# EAGLE design SparkFun_Qwiic_Speaker_Amp (EAGLE 9.6.2)
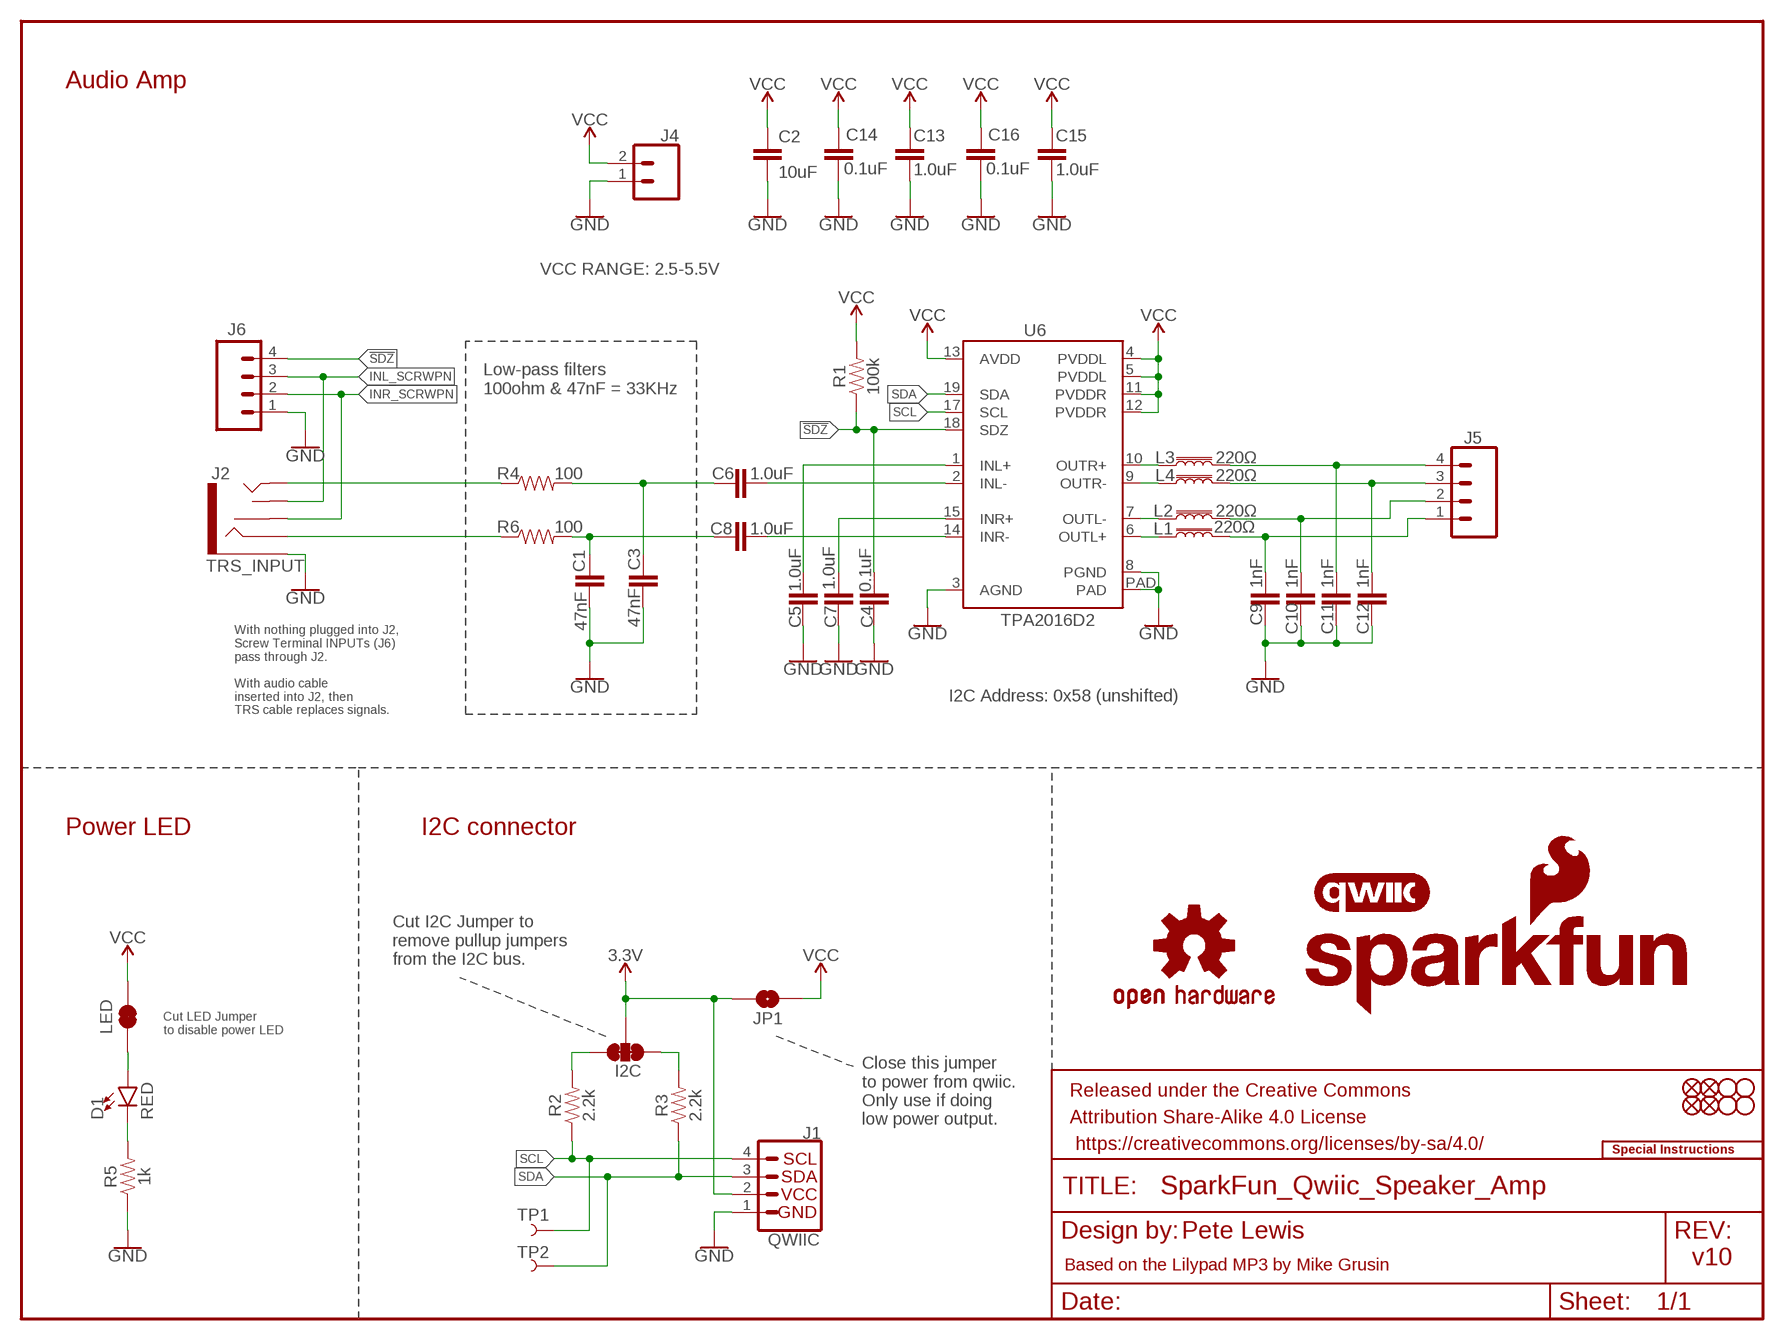
[diagram p0: schematic, sheet 1]

## Parts
C1  47nF  47NF-0402_TIGHT-25V-10%-X7R  [0402-TIGHT]
C2  10uF  10UF-0805-25V-10%  [0805]
C3  47nF  47NF-0402_TIGHT-25V-10%-X7R  [0402-TIGHT]
C4  0.1uF  0.1UF-0402T-16V-10%-X7R-WE  [0402-TIGHT]
C5  1.0uF  1.0UF-0402T-16V-10%  [0402-TIGHT]
C6  1.0uF  1.0UF-0402T-16V-10%  [0402-TIGHT]
C7  1.0uF  1.0UF-0402T-16V-10%  [0402-TIGHT]
C8  1.0uF  1.0UF-0402T-16V-10%  [0402-TIGHT]
C9  1nF  1.0NF/1000PF-0402-25V-10%-X7R  [0402]
C10  1nF  1.0NF/1000PF-0402-25V-10%-X7R  [0402]
C11  1nF  1.0NF/1000PF-0402-25V-10%-X7R  [0402]
C12  1nF  1.0NF/1000PF-0402-25V-10%-X7R  [0402]
C13  1.0uF  1.0UF-0402T-16V-10%  [0402-TIGHT]
C14  0.1uF  0.1UF-0402T-16V-10%-X7R-WE  [0402-TIGHT]
C15  1.0uF  1.0UF-0402T-16V-10%  [0402-TIGHT]
C16  0.1uF  0.1UF-0402T-16V-10%-X7R-WE  [0402-TIGHT]
D1  RED  LED-RED0603  [LED-0603]
FD1  FIDUCIAL1X2  [FIDUCIAL-1X2]
FD2  FIDUCIAL1X2  [FIDUCIAL-1X2]
FD3  FIDUCIAL1X2  [FIDUCIAL-1X2]
FD4  FIDUCIAL1X2  [FIDUCIAL-1X2]
FRAME2  FRAME-LETTER  [CREATIVE_COMMONS]
H1  STAND-OFFTIGHT  [STAND-OFF-TIGHT]
H2  STAND-OFFTIGHT  [STAND-OFF-TIGHT]
H3  STAND-OFFTIGHT  [STAND-OFF-TIGHT]
H4  STAND-OFFTIGHT  [STAND-OFF-TIGHT]
I2C  JUMPER-SMT_3_2-NC_TRACE_SILK  [SMT-JUMPER_3_2-NC_TRACE_SILK]
J1  QWIIC  QWIIC_CONNECTORJS-1MM  [JST04_1MM_RA]
J2  TRS_INPUT  AUDIO_JACK_3.5MM_SMD  [AUDIO-JACK-3.5MM-SMD]
J4  CONN_023.5MM  [SCREWTERMINAL-3.5MM-2]
J5  CONN_04SCREW  [SCREWTERMINAL-3.5MM-4]
J6  SCREW  CONN_04SCREW  [SCREWTERMINAL-3.5MM-4]
JP1  JP1  JUMPER-SMT_2_NO_SILK  [SMT-JUMPER_2_NO_SILK]
L1  220Ω  FERRITE_BEAD-0805-220Ω-100MHZ-2A  [0805]
L2  220Ω  FERRITE_BEAD-0805-220Ω-100MHZ-2A  [0805]
L3  220Ω  FERRITE_BEAD-0805-220Ω-100MHZ-2A  [0805]
L4  220Ω  FERRITE_BEAD-0805-220Ω-100MHZ-2A  [0805]
LED  JUMPER-SMT_2_NC_TRACE_SILK  [SMT-JUMPER_2_NC_TRACE_SILK]
LOGO2  SFE_LOGO_NAME_FLAME.1_INCH  [SFE_LOGO_NAME_FLAME_.1]
LOGO3  QWIIC_LOGO_4MM  [QWIIC_4MM]
LOGO4  OSHW-LOGOS  [OSHW-LOGO-S]
LOGO6  SPECIAL_INSTRUCTIONS-ORDERING  [ORDERING_INSTRUCTIONS]
R1  100k  100KOHM-0402T-1/16W-1%  [0402-TIGHT]
R2  2.2k  2.2KOHM-0402T-1/16W-1%  [0402-TIGHT]
R3  2.2k  2.2KOHM-0402T-1/16W-1%  [0402-TIGHT]
R4  100  100OHM-0402-TIGHT-1/16W-1%  [0402-TIGHT]
R5  1k  1KOHM-0402T-1/16W-1%  [0402-TIGHT]
R6  100  100OHM-0402-TIGHT-1/16W-1%  [0402-TIGHT]
TP1  TEST-POINTTP_15TH_THRU  [TP_15TH]
TP2  TEST-POINTTP_15TH_THRU  [TP_15TH]
U6  TPA2016D2  TPA2016D2RTJ  [QFN-20-0.5MM]

## Nets
3.3V: I2C.2 J1.2 JP1.1
!SDZ!: C4.1 J6.4 R1.1 U6.18(SDZ)
GND: C1.2 C2.2 C3.2 C4.2 C5.1 C7.1 C9.2 C10.2 C11.2 C12.2 C13.2 C14.2 C15.2 C16.2 J1.1 J2.SLEEVE J4.1 J6.1 R5.1 U6.3(AGND) U6.8(PGND) U6.PAD
INL: J2.TIP R4.1
INL_SCRWPN: J2.TSH J6.3
INR: J2.RING R6.1
INR_SCRWPN: J2.RSH J6.2
N$1: L1.1 U6.6(OUTL+)
N$2: L2.1 U6.7(OUTL-)
N$3: C1.1 C8.1 R6.2
N$4: D1.C R5.2
N$5: C3.1 C6.1 R4.2
N$6: D1.A LED.1
N$16: I2C.3 R2.2
N$17: I2C.1 R3.2
N$18: L3.1 U6.10(OUTR+)
N$19: L4.1 U6.9(OUTR-)
N$20: C8.2 U6.14(INR-)
N$21: C5.2 U6.1(INL+)
N$22: C6.2 U6.2(INL-)
N$25: C7.2 U6.15(INR+)
SCL: J1.4 R2.1 TP1.1 U6.17(SCL)
SDA: J1.3 R3.1 TP2.1 U6.19(SDA)
SPK_L_+: C9.1 J5.1 L1.2
SPK_L_-: C10.1 J5.2 L2.2
SPK_R_+: C11.1 J5.4 L3.2
SPK_R_-: C12.1 J5.3 L4.2
VCC: C2.1 C13.1 C14.1 C15.1 C16.1 J4.2 JP1.2 LED.2 R1.2 U6.4(PVDDL) U6.5(PVDDL) U6.11(PVDDR) U6.12(PVDDR) U6.13(AVDD)

## Notes on the sheet
- Audio Amp
- VCC RANGE: 2.5-5.5V
- Low-pass filters
  100ohm & 47nF = 33KHz
- I2C Address: 0x58 (unshifted)
- With nothing plugged into J2,
  Screw Terminal INPUTs (J6)
  pass through J2.
  
  With audio cable
  inserted into J2, then
  TRS cable replaces signals.
- Power LED | I2C connector
- Cut I2C Jumper to 
  remove pullup jumpers 
  from the I2C bus.
- Cut LED Jumper
  to disable power LED
- Close this jumper
  to power from qwiic.
  Only use if doing
  low power output.
- Pete Lewis
- v10
- Based on the Lilypad MP3 by Mike Grusin

## Library data of the parts
C1 C3 = SparkFun-Capacitors:47NF: 47nF ceramic capacitors A capacitor is a passive two-terminal electrical component used to store electrical energy temporarily in an electric field.; PROD_ID: CAP-14243
C2 = SparkFun-Capacitors:10UF: 10.0µF ceramic capacitors A capacitor is a passive two-terminal electrical component used to store electrical energy temporarily in an electric field.; PROD_ID: CAP-14259
C4 C14 C16 = SparkFun-Capacitors:0.1UF: 0.1µF ceramic capacitors A capacitor is a passive two-terminal electrical component used to store electrical energy temporarily in an electric field.; PROD_ID: CAP-16507
C5-C8 C13 C15 = SparkFun-Capacitors:1.0UF: 1µF ceramic capacitors A capacitor is a passive two-terminal electrical component used to store electrical energy temporarily in an electric field.; PROD_ID: CAP-12417
C9-C12 = SparkFun-Capacitors:1.0NF/1000PF: 1nF/1,000pF ceramic capacitors A capacitor is a passive two-terminal electrical component used to store electrical energy temporarily in an electric field.; PROD_ID: CAP-15061
D1 = SparkFun-LED:LED-RED: Red SMD LED Used in manufacturing of most products at SparkFun Packages: 0603 - SMD 0603 package [Product Link] <http://docs.avagotech.com/docs/AV02-0551EN> 0603 SMART - SMD 0603 SMART package ( more efficient and expensive)[Product Link] <http://www.osram-os.com/Graphics/XPic2/00077099_0.pdf> 1206 - SMD1206 package [Product Link] <https://www.sparkfun.com/datasheets/DevTools/LilyPad/Q150OVS4.pdff> SparkFun Products: Pro Mini 328 -5V <https://www.sparkfun.com/products/821> RedBoard <https://www.sparkfun.com/products/12757> IOIO-OTG <https://www.sparkfun.com/products/13613>; PROD_ID: DIO-00819
FD1-FD4 = SparkFun-Aesthetics:FIDUCIAL: Fiducial Alignment Points Point-of-reference for pick-and-place machines and other optical instruments.
FRAME2 = SparkFun-Aesthetics:FRAME-LETTER: Schematic Frame - Letter Standard 8.5x11 US Letter frame
H1-H4 = SparkFun-Hardware:STAND-OFF: Stand Off Drill holes for mechanically mounting via screws, standoffs, etc. Note: Use the keepout ring to avoid running the screw head into surrounding components. Variant Overviews STAND-OFF - Mechanical footprint for a #4 phillips button head screw. STAND-OFF-TIGHT - Mechanical footprint for a #4 phillips button head screw, Example SparkFun Products Screw - Phillips Head (1/4", 4-40, 10 pack) <https://www.sparkfun.com/products/10453> (PRT-10453) Screw - Phillips Head (1/2", 4-40, 10 pack) <https://www.sparkfun.com/products/10452> (PRT-10452) Screw - Phillips Head (3/4", 4-40, 10 pack) <https://www.sparkfun.com/products/10451> (PRT-10451) Screw - Phillips Head (1", 4-40, 10 pack) <https://www.sparkfun.com/products/10450> (PRT-10450)
I2C = SparkFun-Jumpers:JUMPER-SMT_3_2-NC_TRACE: Normally closed trace jumper (2 of 2 connections) This jumper has a trace between all three pads so they are normally closed (NC). Use a razor knife to open the connection(s). For best results follow the IPC guidelines for cutting traces: Cutout at least 0.063 mm (0.005 in). Remove all loose material to clean up the cut area. Seal the cut with an approved epoxy. Reapply solder to reclose the connection(s).
J1 = SparkFun-Connectors:QWIIC_CONNECTOR: SparkFun I2C Standard Qwiic Connector An SMD 1mm pitch JST connector makes it easy and quick (get it? Qwiic?) to connect I2C devices to each other. The Qwiic system <http://www.sparkfun.com/qwiic> enables fast and solderless connection between popular platforms and various sensors and actuators. We carry 200mm <https://www.sparkfun.com/products/14204>, 100mm <https://www.sparkfun.com/products/14205>, 50mm <https://www.sparkfun.com/products/14206>, and breadboard friendly <https://www.sparkfun.com/products/14207> Qwiic cables. We also offer 10 pcs strips <https://www.sparkfun.com/products/14323> the SMD connectors.; PROD_ID: CONN-13694; VALUE: QWIIC_RIGHT_ANGLE
J2 = SparkFun-Connectors:AUDIO_JACK_3.5MM: Audio Jack 3.5mm variants of PTH and SMT stereo audio jack with bypass switches. SparkFun Products: SparkFun SparkPunk Sound Kit <[https://www.sparkfun.com/products/11177]> - PTH MP3 Trigger <https://www.sparkfun.com/products/13720> -3.5mm SMD SparkFun PicoBoard <https://www.sparkfun.com/products/11888>- 2.5mm SMD; PROD_ID: CONN-10353
J4 = SparkFun-Connectors:CONN_02: Multi connection point. Often used as Generic Header-pin footprint for 0.1 inch spaced/style header connections On any of the 0.1 inch spaced packages, you can populate with these: Break Away Headers - Straight <https://www.sparkfun.com/products/116> (PRT-00116) Break Away Male Headers - Right Angle <https://www.sparkfun.com/products/553> (PRT-00553) Female Headers <https://www.sparkfun.com/products/115> (PRT-00115) Break Away Headers - Machine Pin <https://www.sparkfun.com/products/117> (PRT-00117) Break Away Female Headers - Swiss Machine Pin <https://www.sparkfun.com/products/743> (PRT-00743) For SCREWTERMINALS and SPRING TERMINALS visit here: Screw Terimnals on SparkFun.com <https://www.sparkfun.com/search/results?term=Screw+Terminals> (5mm/3.5mm/2.54mm spacing) This device is also useful as a general connection point to wire up your design to another part of your project. Our various solder wires solder well into these plated through hole pads. Hook-Up Wire - Assortment (Stranded, 22 AWG) <https://www.sparkfun.com/products/11375> (PRT-11375) Hook-Up Wire - Assortment (Solid Core, 22 AWG) <https://www.sparkfun.com/products/11367> (PRT-11367) View the entire wire category on our website here <https://www.sparkfun.com/categories/141> Special notes: Molex polarized connector foot print use with: PRT-08233 with associated crimp pins and housings. 2.54_SCREWTERM for use with PRT-10571. 3.5mm Screw Terminal footprints for PRT-08084 5mm Screw Terminal footprints for use with PRT-08432; PROD_ID: CONN-08399
J5 J6 = SparkFun-Connectors:CONN_04: Multi connection point. Often used as Generic Header-pin footprint for 0.1 inch spaced/style header connections On any of the 0.1 inch spaced packages, you can populate with these: Break Away Headers - Straight <https://www.sparkfun.com/products/116> (PRT-00116) Break Away Male Headers - Right Angle <https://www.sparkfun.com/products/553> (PRT-00553) Female Headers <https://www.sparkfun.com/products/115> (PRT-00115) Break Away Headers - Machine Pin <https://www.sparkfun.com/products/117> (PRT-00117) Break Away Female Headers - Swiss Machine Pin <https://www.sparkfun.com/products/743> (PRT-00743) For SCREWTERMINALS and SPRING TERMINALS visit here: Screw Terimnals on SparkFun.com <https://www.sparkfun.com/search/results?term=Screw+Terminals> (5mm/3.5mm/2.54mm spacing) This device is also useful as a general connection point to wire up your design to another part of your project. Our various solder wires solder well into these plated through hole pads. Hook-Up Wire - Assortment (Stranded, 22 AWG) <https://www.sparkfun.com/products/11375> (PRT-11375) Hook-Up Wire - Assortment (Solid Core, 22 AWG) <https://www.sparkfun.com/products/11367> (PRT-11367) View the entire wire category on our website here <https://www.sparkfun.com/categories/141> Special notes: Molex polarized connector foot print use with SKU : PRT-08231 with associated crimp pins and housings. 1MM SMD Version SKU: PRT-10208; PROD_ID: CONN-14485
JP1 = SparkFun-Jumpers:JUMPER-SMT_2_NO: Normally open jumper This jumper has two pads in close proximity to each other. Apply solder to close the connection. Round pads are easier to solder for beginners, but are a lot larger. SparkFun Product that uses the round pads: SparkFun EL Sequencer <https://www.sparkfun.com/products/12781>
L1-L4 = SparkFun-Coils:FERRITE_BEAD: Ferrite Bead (blocks, cores, rings, chokes, etc.) Inductor with layers of ferrite used to suppress high frequencies. Often used to isolate high frequency noise. SparkFun Products: IOIO-OTG - V2.2 <https://www.sparkfun.com/products/13613> SparkFun SAMD21 Mini Breakout <https://www.sparkfun.com/products/13664> SparkFun 6 Degrees of Freedom Breakout - LSM6DS3 <https://www.sparkfun.com/products/13339> SparkFun SAMD21 Dev Breakout <https://www.sparkfun.com/products/13672> Lilypad MP3 <https://www.sparkfun.com/products/11013>; PROD_ID: NDUC-10201
LED = SparkFun-Jumpers:JUMPER-SMT_2_NC_TRACE: Normally closed trace jumper This jumper has a trace between two pads so it's normally closed (NC). Use a razor knife to open the connection. For best results follow the IPC guidelines for cutting traces: Cutout at least 0.063 mm (0.005 in). Remove all loose material to clean up the cut area. Seal the cut with an approved epoxy. Reapply solder to reclose the connection.
LOGO2 = SparkFun-Aesthetics:SFE_LOGO_NAME_FLAME: SparkFun Font Logo w/ Flame This is the SparkFun full logo. The logo on the schematic will always be the same size; the package variant is the height of the flame part of the logo. Default layer for the logo on the board is tSilk.
LOGO3 = SparkFun-Aesthetics:QWIIC_LOGO: Qwiic Logos for placement on schematic and PCB. The 5.5mm silk logo is best for placing next to Qwiic connector.
LOGO4 = SparkFun-Aesthetics:OSHW-LOGO: Open-Source Hardware (OSHW) Logo This logo indicates the piece of hardware it is found on incorporates a OSHW license and/or adheres to the definition of open source hardware found here: http://freedomdefined.org/OSHW
LOGO6 = SparkFun-Aesthetics:SPECIAL_INSTRUCTIONS: Special Ordering/Production Instructions Alert Symbol for special PCB ordering instructions or unique production process warnings. Ordering Instructions Production Instructions Types of information that should be added to box: Copper weight Soldermask color Silk color PCB thickness Number of layers PCB Standard: 1.6mm FR4 1 oz copper immersion silver plating red soldermask white silkscreen Types of information that should be added to box: Special wash requirements Depaneling instructions Humidification Glue curing Default text settings: 0.07 inch 9% ratio 50% line distance; PROD_ID: PCB-17002
R1 = SparkFun-Resistors:100KOHM: 100kΩ resistor A resistor is a passive two-terminal electrical component that implements electrical resistance as a circuit element. Resistors act to reduce current flow, and, at the same time, act to lower voltage levels within circuits. - Wikipedia; PROD_ID: RES-13495
R2 R3 = SparkFun-Resistors:2.2KOHM: 2.2kΩ resistor A resistor is a passive two-terminal electrical component that implements electrical resistance as a circuit element. Resistors act to reduce current flow, and, at the same time, act to lower voltage levels within circuits. - Wikipedia; PROD_ID: RES-14341
R4 R6 = SparkFun-Resistors:100OHM: 100Ω resistor A resistor is a passive two-terminal electrical component that implements electrical resistance as a circuit element. Resistors act to reduce current flow, and, at the same time, act to lower voltage levels within circuits. - Wikipedia; PROD_ID: RES-14962
R5 = SparkFun-Resistors:1KOHM: 1kΩ resistor A resistor is a passive two-terminal electrical component that implements electrical resistance as a circuit element. Resistors act to reduce current flow, and, at the same time, act to lower voltage levels within circuits. - Wikipedia; PROD_ID: RES-14342
TP1 TP2 = SparkFun-Connectors:TEST-POINT: SparkFun Test Points Bare copper test points for troubleshooting or In-Circuit-Testing. These are used by our Production team for verifying production board runs using pogo-pins on test beds. SparkFun Products: SparkFun LSM9DS1 Breakout <https://www.sparkfun.com/products/13284> SparkFun PSOC <https://www.sparkfun.com/products/13714> SparkFun Load Cell Amplifier <https://www.sparkfun.com/products/13879>
U6 = temp:TPA2016D2: 2.8-W/Ch Stereo Class-D Audio Amplifier with I2C volume control, DRC and AGC The TPA2016D2 is a stereo, filter-free Class-D audio power amplifier with volume control, dynamic range compression (DRC) and automatic gain control (AGC). It is available in a 2.2 mm x 2.2 mm WCSP package and 20-pin QFN package. The DRC/AGC function in the TPA2016D2 is programmable via a digital I2C interface. The DRC/AGC function can be configured to automatically prevent distortion of the audio signal and enhance quiet passages that are normally not heard. The DRC/AGC can also be configured to protect the speaker from damage at high power levels and compress the dynamic range of music to fit within the dynamic range of the speaker. The gain can be selected from ?28 dB to +30 dB in 1-dB steps. The TPA2016D2 is capable of driving 1.7 W/Ch at 5 V or750 mW/Ch at 3.6 V into 8 ? load or 2.8 W/Ch at 5 V or 1.5 W/Ch at 3.6 V into 4 ? load. The device features independent software shutdown controls for each channel and also provides thermal and short circuit protection. In addition to these features, a fast start-up time and small package size make the TPA2016D2 an ideal choice for cellular handsets, PDAs and other portable applications. · 1.7 W/Ch Into 8 ? at 5 V (10% THD+N) · 750 mW/Ch Into 8 ? at 3.6 V (10% THD+N) · 2.8 W/Ch Into 4 ? at 5 V (10% THD+N) · 1.5 W/Ch Into 4 ? at 3.6 V (10% THD+N) · Power Supply Range: 2.5 V to 5.5 V · Flexible Operation With/Without I2C · Programmable DRC/AGC Parameters · Digital I2C Volume Control · Selectable Gain from ?28 dB to 30 dB in 1-dB Steps (when compression is used) · Selectable Attack, Release and Hold Times · 4 Selectable Compression Ratios · Low Supply Current: 3.5 mA · Low Shutdown Current: 0.2 mA · High PSRR: 80 dB · Fast Start-up Time: 5 ms circuit protection. · AGC Enable/Disable Function · Limiter Enable/Disable Function · Short-Circuit and Thermal Protection; PROD_ID: IC-11061

## Net classes
1 VCC: width 0.254 mm, clearance 0.254 mm

## Board
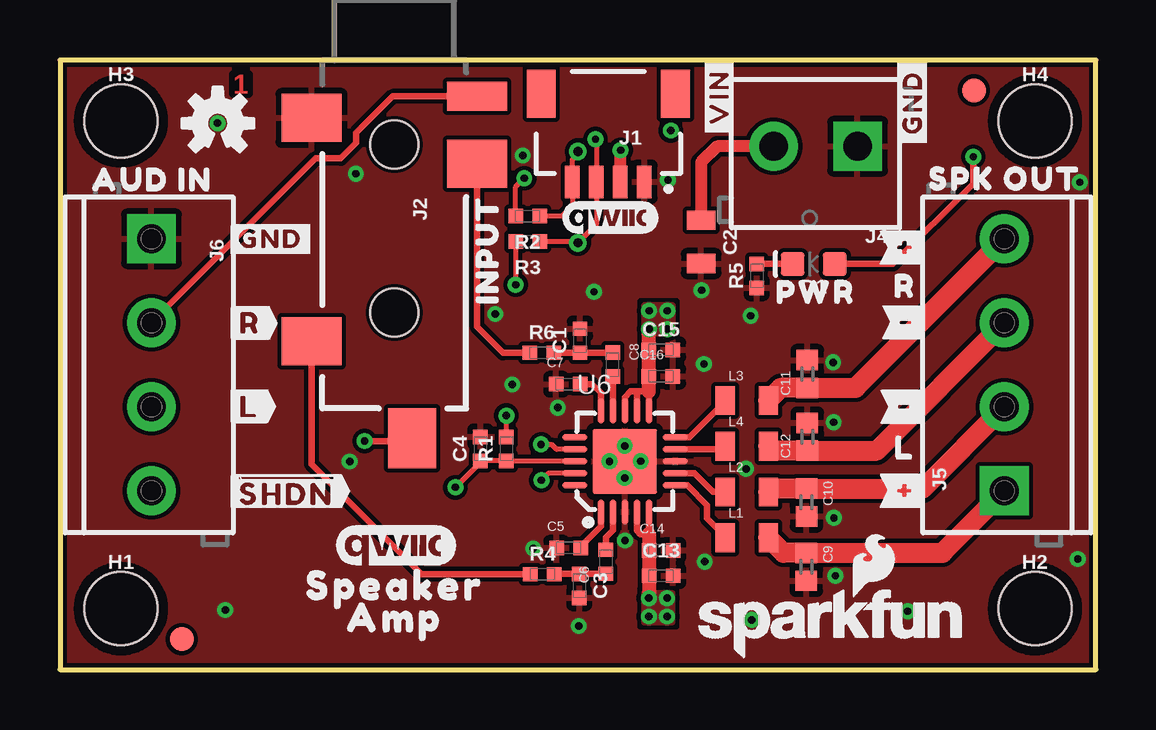
[diagram p1: board, top side]
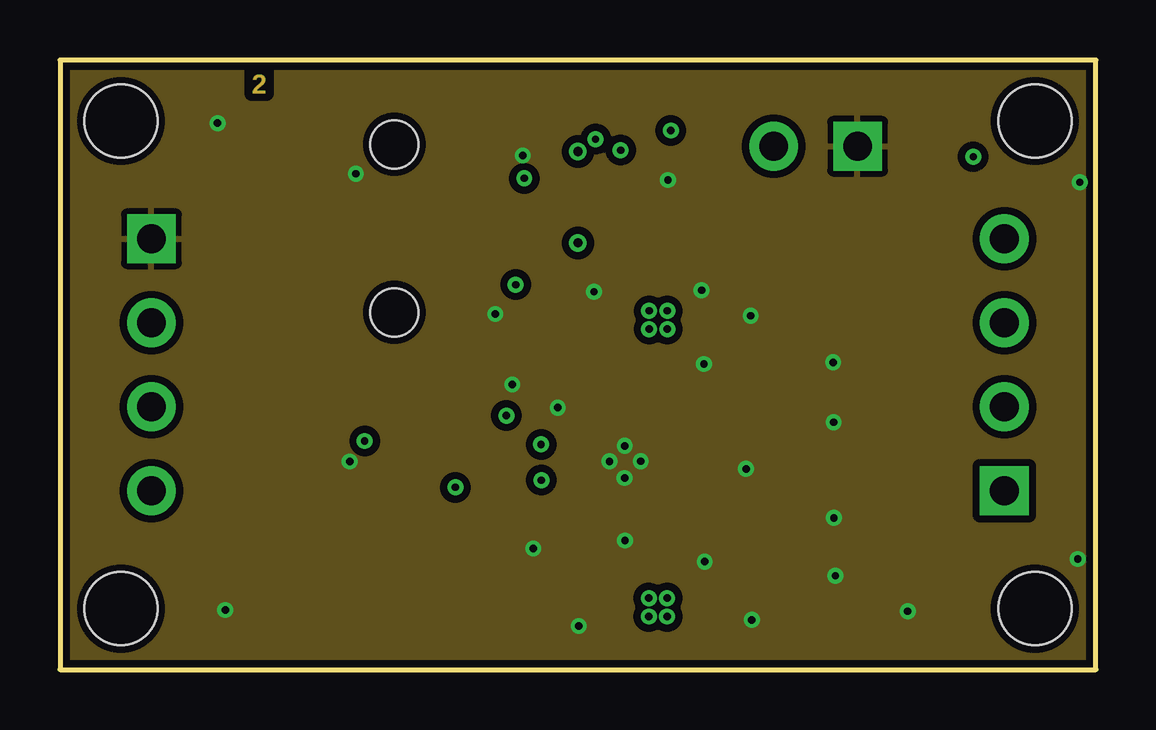
[diagram p2: board, inner layer Route2]
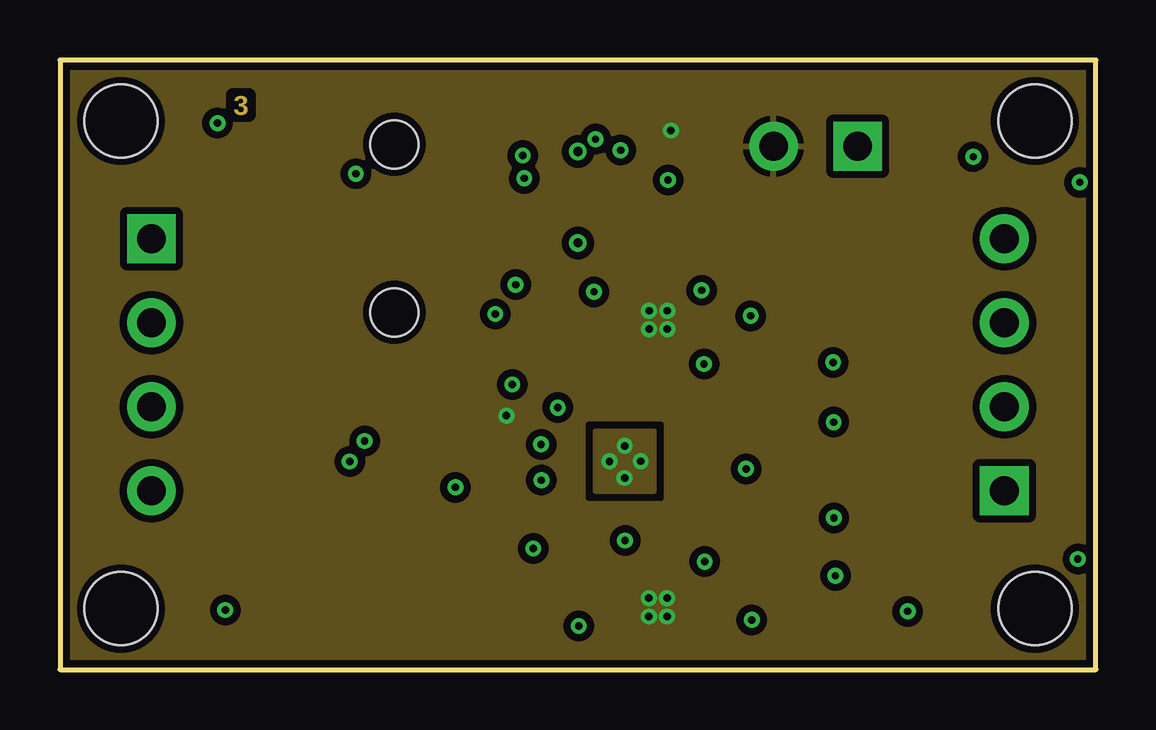
[diagram p3: board, inner layer Route15]
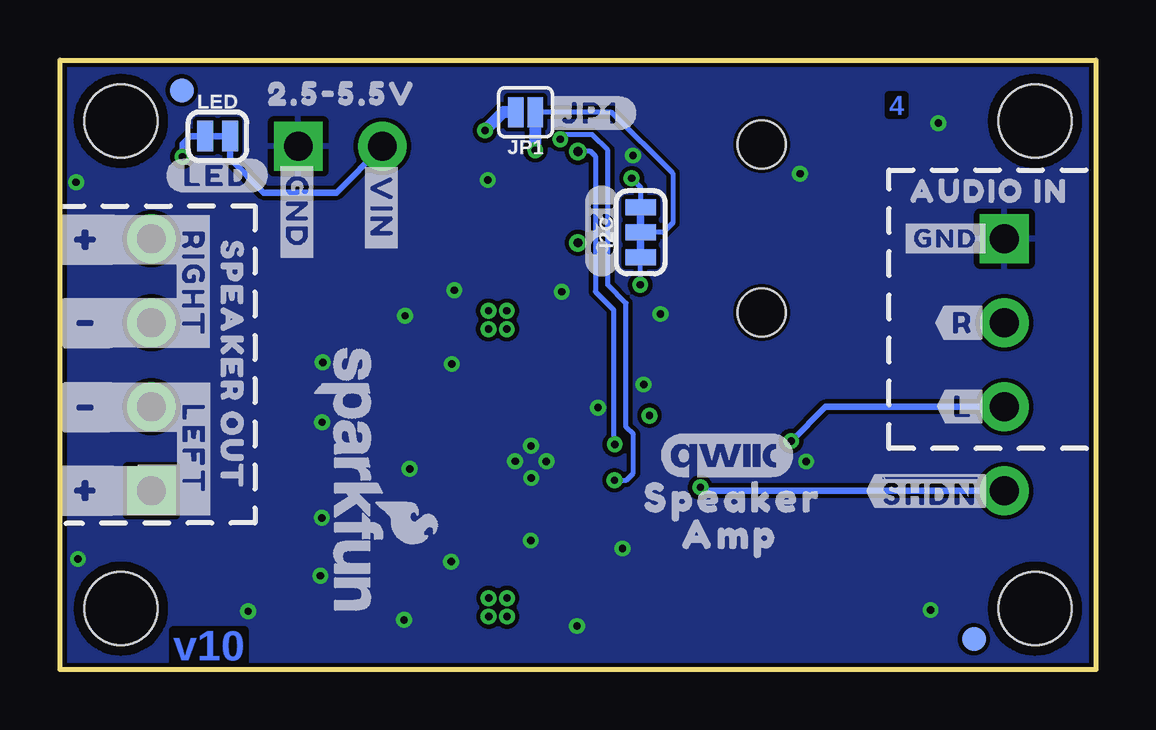
[diagram p4: board, bottom side, seen from below]

Size 43.18 x 25.4 mm. Coordinates in mm from the lower left corner, seen from the top.
Outline: 0,0 43.18,0 43.18,25.4 0,25.4 0,0
Copper layers (1+2*15+16): Top 0.035559375mm / dielectric 0.47751875mm / Route2 0.035559375mm / dielectric 0.47751875mm / Route15 0.035559375mm / dielectric 0.47751875mm / Bottom 0.035559375mm
Design rules "SparkFun-4-Layer-General-JLCPCB": minimum track width 7mil, minimum drill 12mil, track to track 7mil, track to pad 7mil, pad to pad 7mil, via to via 7mil, smd to smd 7mil, copper to edge 7mil, drill to drill 7mil, minimum pad ring 7mil, minimum via ring 7mil, stop-mask expansion 3mil, vias tented up to drill 25mil, thermal gap 10mil

### Footprints (pad centres in the part's own frame; a part is rotated, then mirrored left to right if it is on the bottom)
0402-TIGHT = smd 0.6 x 0.6: 1 -0.5,0; 2 0.5,0
0805 = smd 0.8 x 1.2: 1 -0.9,0; 2 0.9,0
0402 = smd 0.85 x 0.9: 1 -0.58,0; 2 0.58,0
LED-0603 = smd 1 x 1: A -0.877,0; C 0.877,0
FIDUCIAL-1X2 = smd 1 x 1: 1 0,0
STAND-OFF-TIGHT = hole 3.048: 0,0
SMT-JUMPER_3_2-NC_TRACE_SILK = smd 0.66 x 1.27: 1 -1.041,0; 2 0,0; 3 1.041,0
JST04_1MM_RA = smd 0.6 x 1.35: 1 -1.5,0; 2 -0.5,0; 3 0.5,0; 4 1.5,0 | smd 1.2 x 2: NC1 2.8,-3.675; NC2 -2.8,-3.675
AUDIO-JACK-3.5MM-SMD = smd 2 x 2.5: RING 4.3,3.45; SLEEVE 2.4,-3.45; TIP 11.7,-3.45 | smd 1.2 x 2.5: RSH 1.5,3.45 | smd 2.5 x 2: TSH 15.75,0.75 | hole 2: 3.5,0; 10.5,0
SCREWTERMINAL-3.5MM-2 = drill 1.2 pad 2.032 square: 1 0,0 | drill 1.2 pad 2.032: 2 3.5,0
SCREWTERMINAL-3.5MM-4 = drill 1.2 pad 2.032 square: 1 0,0 | drill 1.2 pad 2.032: 2 3.5,0; 3 7,0; 4 10.5,0
SMT-JUMPER_2_NO_SILK = smd 0.635 x 1.27: 1 -0.406,0; 2 0.406,0
SMT-JUMPER_2_NC_TRACE_SILK = smd 0.66 x 1.27: 1 -0.521,0; 2 0.521,0
TP_15TH = drill 0.381 pad 0.61: 1 0,0
QFN-20-0.5MM = smd 0.28 x 1.05: 1 -1,-2.1; 2 -0.5,-2.1; 3 0,-2.1; 4 0.5,-2.1; 5 1,-2.1; 11 1,2.1; 12 0.5,2.1; 13 0,2.1; 14 -0.5,2.1; 15 -1,2.1 | smd 1.05 x 0.28: 6 2.1,-1; 7 2.1,-0.5; 8 2.1,0; 9 2.1,0.5; 10 2.1,1; 16 -2.1,1; 17 -2.1,0.5; 18 -2.1,0; 19 -2.1,-0.5; 20 -2.1,-1 | smd 2.7 x 2.7: PAD 0,0

### Placement (x,y rotation side)
C1  21.68,13.7 90 top
C2  26.73,17.82 270 top
C3  21.65,3.49 270 top
C4  17.53,9.19 90 top
C5  21.2,5.07 0 top
C6  22.75,4.49 90 top
C7  21.19,11.89 0 top
C8  23.04,12.71 270 top
C9  31.11,4.28 270 top
C10  31.12,6.96 270 top
C11  31.15,12.32 90 top
C12  31.15,9.7 90 top
C13  25.05,3.91 0 top
C14  25.05,4.97 0 top
C15  25.05,13.32 0 top
C16  25.05,12.22 0 top
D1  31.42,16.9 180 top
FD1  5.08,1.27 0 top
FD2  5.08,1.27 0 bottom
FD3  38.1,24.13 0 top
FD4  38.1,24.13 0 bottom
FRAME2  -7.62,-20.32 0 top  (outside the outline)
H1  2.54,2.54 0 top
H2  40.64,2.54 0 top
H3  2.54,22.86 0 top
H4  40.64,22.86 0 top
I2C  18.97,18.22 90 bottom
J1  22.86,20.32 180 top
J2  13.94,25.39 270 top
J4  33.25,21.81 180 top
J5  39.37,7.45 90 top
J6  3.81,17.95 270 top
JP1  23.77,23.22 180 bottom
L1  28.63,5.5 0 top
L2  28.63,7.4 0 top
L3  28.63,11.21 0 top
L4  28.63,9.31 0 top
LED  36.61,22.23 0 bottom
LOGO1  QWIIC_LOGO_4MM  [QWIIC_5MM]  13.98,5.19 0 top
LOGO2  31.12,7.85 270 bottom
LOGO3  22.95,18.82 0 top
LOGO4  6.58,22.77 0 top
LOGO6  55.88,44.45 0 top  (outside the outline)
R1  18.61,9.2 90 top
R2  19.49,18.9 180 top
R3  19.49,17.84 180 top
R4  20.11,3.97 0 top
R5  29.04,16.4 90 top
R6  20.09,13.2 0 top
TP1  21.59,21.59 0 top
TP2  21.59,17.78 0 top
U6  23.55,8.67 0 top
U$1  [SPEAKER0]  13.97,3.5 0 top
U$2  [#I2C#0]  20.59,18.28 270 bottom
U$3  [INPUT0]  17.81,17.52 90 top
U$4  [SPEAKER0]  15.12,7.15 0 bottom
U$5  [PWR26]  31.5,15.73 0 top
U$6  [AMP0]  13.96,2.17 0 top
U$7  [QWIIC_5.5MM]  15.37,8.93 0 bottom
U$8  [AMP0]  15.25,5.63 0 bottom
U$9  [###15]  35.26,7.45 0 top
U$10  [###16]  35.3,14.47 0 top
U$11  [###16]  35.23,10.95 0 top
U$12  [###15]  35.27,17.58 0 top
U$13  [##SHDN##3]  6.91,7.44 0 bottom
U$14  [R21]  35.23,15.98 0 top
U$15  [#VIN#24]  27.48,23.85 90 top
U$16  [L5]  35.22,9.25 0 top
U$17  [#R#11]  7.92,14.44 0 top
U$18  [#L#33]  5.52,10.97 0 bottom
U$19  [#L#12]  7.89,10.96 0 top
U$20  [#GND#25]  35.54,23.63 90 top
U$21  [SPK_OUT22]  39.41,20.45 0 top
U$22  [AUD_IN23]  3.85,20.41 0 top
U$23  [2#5#5#5V24]  31.42,23.99 0 bottom
U$24  [#LED#27]  36.63,20.58 0 bottom
U$25  [#GND#25]  8.78,17.95 0 top
U$26  [#VIN#30]  29.78,19.24 270 bottom
U$27  [#GND#31]  33.31,19.07 270 bottom
U$28  [#R#34]  5.54,14.45 0 bottom
U$29  [#GND#25]  6.26,17.96 0 bottom
U$30  [SFE_LOGO_NAME_FLAME_.1]  32.18,1.93 0 top
U$31  [###40]  42.04,17.91 0 bottom
U$32  [###40]  42.04,7.45 0 bottom
U$33  [SPEAKER_OUT37]  36.02,12.68 270 bottom
U$34  [AUDIO_IN39]  4.45,19.94 0 bottom
U$35  [###41]  42.04,14.44 0 bottom
U$36  [###41]  42.04,10.92 0 bottom
U$37  [#LEFT#43]  37.61,9.17 270 bottom
U$38  [#RIGHT#44]  37.63,16.06 270 bottom
U$39  [#JP1#2]  21.07,23.19 0 bottom
U$40  [##SHDN##2]  9.44,7.45 0 top

### Tracks (layer width: path | path; a pad name or v marks a point on that pad's centre or on a via)
3.3V  (via drill 0.3)
  Top 0.508: J1.2 v23.37,21.64
  Bottom 0.203: I2C.2 18.03,18.22 17.64,18.61 17.64,20.67 20.18,23.22 JP1.1
  Bottom 0.508: JP1.1 v23.37,21.64
!SDZ!  (via drill 0.3)
  Top 0.203: U6.18 18.61,8.67 R1.1 C4.1 17.53,8.64 v16.48,7.59
  Bottom 0.279: J6.4 16.34,7.45 v16.48,7.59
GND  (via drill 0.3)
  other vias: 6.57,22.77 32.23,12.8 32.25,10.31 32.26,6.32 32.32,3.91 23.54,9.32 22.9,8.67 23.54,7.98 24.21,8.68 28.79,14.74 26.85,12.73 23.55,5.38 28.6,8.36 28.84,2.07 26.87,4.5 19.73,5.05 20.75,10.92 22.26,15.74 25.35,20.4 21.63,1.82 6.89,2.48 35.34,2.43 26.74,15.81 18.85,11.88 42.51,20.3 42.43,4.61 19.29,21.42 12.33,20.66 18.15,14.82 12.08,8.67
  pour Top (rank 2): 0,0 43.09,0 43.09,25.52 0,25.52
  pour Bottom (isolate 0.012): 43.09,0 0,0 0,25.52 43.09,25.52
  pour Bottom (isolate 0.305): 0,0 0,25.4 43.18,25.4 43.18,0
  pour Route15 (isolate 0.305): 22.3,9.92 22.3,7.43 24.79,7.43 24.79,9.92
  pour Route2 (isolate 0.305): 0,0 0,25.4 43.18,25.4 43.18,0
INL
  Top 0.279: R4.1 15.08,3.97 10.49,8.56 J2.TIP
INL_SCRWPN  (via drill 0.3)
  Top 0.279: v12.7,9.53 14.57,9.53 J2.TSH
  Bottom 0.279: J6.3 11.28,10.95 v12.7,9.53
INR
  Top 0.279: J2.RING 17.39,14.28 18.47,13.2 R6.1
INR_SCRWPN
  Top 0.279: J2.RSH 13.88,23.89 12.35,22.36 12.35,21.95 11.7,21.3 10.66,21.3 J6.2
N$1
  Top 0.279: U6.6 26.15,7.67 26.98,6.85 26.98,6.3 27.73,5.55 L1.1
N$2
  Top 0.279: U6.7 26.45,8.17 27.22,7.4 L2.1
N$3
  Top 0.279: C8.1 C1.1 R6.2
N$4
  Top 0.279: D1.C R5.2
N$5
  Top 0.279: R4.2 20.63,3.99 C3.1 C6.1
N$6  (via drill 0.3)
  Top 0.279: D1.A 34.73,16.9 38.07,20.25 v38.07,21.37
  Bottom 0.279: v38.07,21.37 38.07,21.91 37.76,22.23 LED.1
N$16  (via drill 0.3)
  Top 0.203: R2.2 18.99,20.11 v19.35,20.47
  Bottom 0.203: v19.35,20.47 18.97,20.09 I2C.3
N$17  (via drill 0.3)
  Top 0.203: R3.2 v18.99,16.04
  Bottom 0.203: v18.99,16.04 18.97,16.06 I2C.1
N$18
  Top 0.279: U6.10 26.25,9.67 27.73,11.15 L3.1
N$19
  Top 0.279: U6.9 27.59,9.17 L4.1
N$20
  Top 0.279: U6.14 C8.2
N$21
  Top 0.279: U6.1 22.55,5.97 21.7,5.12 C5.2
N$22
  Top 0.279: U6.2 23.05,5.81 22.77,5.53 22.77,5.01 C6.2
N$25
  Top 0.279: U6.15 22.55,11.53 22.18,11.89 C7.2
SCL  (via drill 0.3)
  Top 0.203: U6.17 20.7,9.17 20.49,9.38 v20.06,9.38 | R2.1 20.9,18.89 21.36,19.36 J1.4 21.36,21.25 21.59,21.48 TP1.1
  Bottom 0.203: v20.06,9.38 20.1,9.43 20.1,14.99 20.87,15.75 20.87,21.4 21.06,21.59 TP1.1
SDA  (via drill 0.3)
  Top 0.203: U6.19 20.35,8.17 v20.07,7.89 | v22.32,22.1 22.36,22.07 J1.3 22.36,18.55 TP2.1 21.53,17.84 R3.1
  Bottom 0.203: v20.07,7.89 19.58,7.89 19.28,8.19 19.28,9.81 19.58,10.11 19.58,15.27 20.34,16.03 20.34,21.63 21,22.29 22.13,22.29 v22.32,22.1
SPK_L_+
  Top 0.838: J5.1 36.78,4.86 C9.1 30.16,4.86 L1.2
SPK_L_-
  Top 0.838: J5.2 35.97,7.54 C10.1 29.67,7.54 L2.2
SPK_R_+
  Top 0.838: J5.4 33.16,11.74 C11.1 30.05,11.74 L3.2
SPK_R_-
  Top 0.838: J5.3 34.04,9.12 C12.1 29.71,9.12 L4.2
VCC  (via drill 0.3)
  Top 0.203: R1.2 v18.61,10.58
  Top 0.279: U6.5 24.55,5.65 24.2,5.65 24.05,5.8 U6.4 | C14.1 | C13.1 | C13.1 | U6.11 24.55,11.6 24.13,11.6 | C16.1 | 24.55,14.18 v24.56,14.19 | U6.13 23.55,11.36 23.79,11.6 24.13,11.6 | U6.12 24.05,11.52 24.13,11.6 | C15.1
  Top 0.508: J4.2 27.4,21.81 26.73,21.13 C2.1
  Top 0.584: 24.55,5.65 C14.1 | C14.1 C13.1 | C13.1 v24.55,2.98 | 24.55,11.6 C16.1 | C16.1 C15.1 24.55,14.18
  Bottom 0.279: LED.2 36.09,21.28 34.69,19.87 31.65,19.87 29.75,21.78 J4.2
  Bottom 0.508: JP1.2 24.7,23.22 v25.46,22.46
  other vias: 24.55,2.21 25.31,2.21 24.56,14.95 25.32,14.95 25.31,2.98 25.32,14.19
  pour Route15 (isolate 0.305, rank 2): 0,0 0,25.4 43.18,25.4 43.18,0
  pour Top (isolate 0.305): 25.57,15.2 24.32,15.2 24.32,13.96 25.57,13.96
  pour Top (isolate 0.305): 25.56,3.19 24.31,3.19 24.31,1.96 25.56,1.96

### Text on the board
Top: 1
Route2: 2
Route15: 3
Bottom: 4 | v10
Measures: UNITS: INCHES
tDocu: Board Thickness is 1.6mm | 4-Layer | HASL Finish | Pete Lewis | Based on the Lilypad MP3 by Mike Grusin